# EAGLE design mmc5toflash (EAGLE 9.6.2)
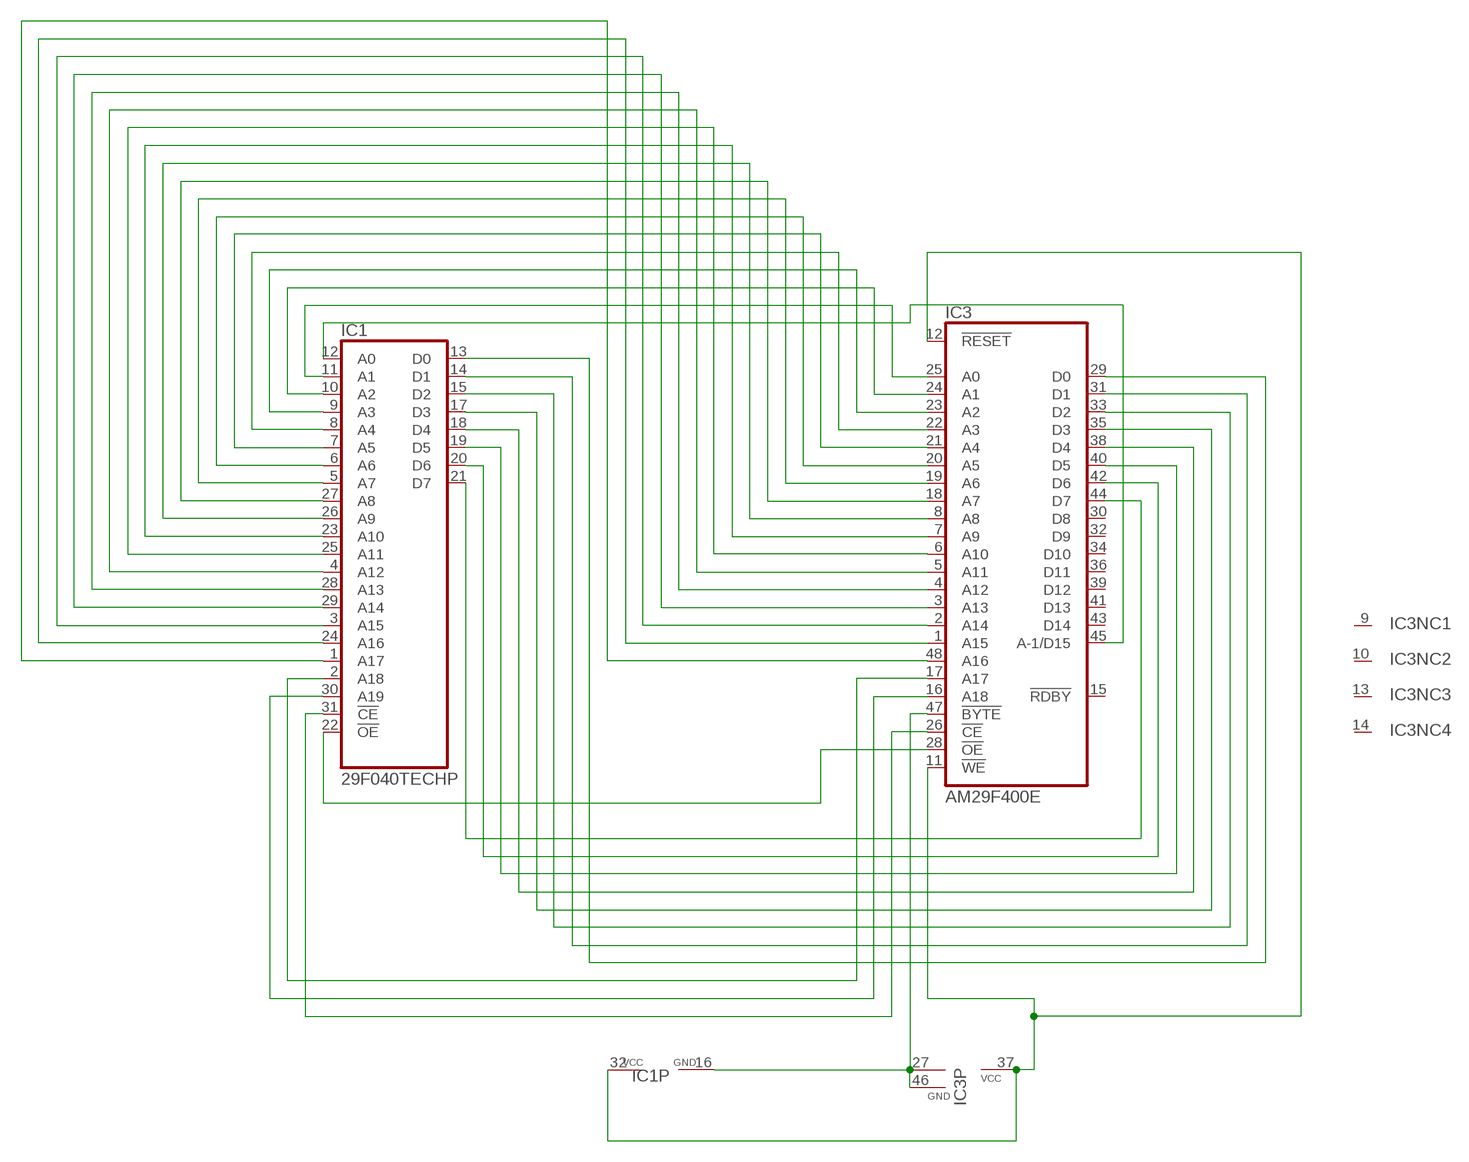
[diagram p0: schematic, sheet 1]

## Parts
IC1  29F040TECHP  [DIL32-3]
IC3  AM29F400E  [TSOP48]

## Nets
MMC5-!CE: IC1.31(!CE) IC3.26(!CE)
MMC5-!OE: IC1.22(!OE) IC3.28(!OE)
MMC5-A0: IC1.12(A0) IC3.45(A-1/D15)
MMC5-A1: IC1.11(A1) IC3.25(A0)
MMC5-A2: IC1.10(A2) IC3.24(A1)
MMC5-A3: IC1.9(A3) IC3.23(A2)
MMC5-A4: IC1.8(A4) IC3.22(A3)
MMC5-A5: IC1.7(A5) IC3.21(A4)
MMC5-A6: IC1.6(A6) IC3.20(A5)
MMC5-A7: IC1.5(A7) IC3.19(A6)
MMC5-A8: IC1.27(A8) IC3.18(A7)
MMC5-A9: IC1.26(A9) IC3.8(A8)
MMC5-A10: IC1.23(A10) IC3.7(A9)
MMC5-A11: IC1.25(A11) IC3.6(A10)
MMC5-A12: IC1.4(A12) IC3.5(A11)
MMC5-A13: IC1.28(A13) IC3.4(A12)
MMC5-A14: IC1.29(A14) IC3.3(A13)
MMC5-A15: IC1.3(A15) IC3.2(A14)
MMC5-A16: IC1.24(A16) IC3.1(A15)
MMC5-A17: IC1.1(A17) IC3.48(A16)
MMC5-A18: IC1.2(A18) IC3.17(A17)
MMC5-A19: IC1.30(A19) IC3.16(A18)
MMC5-D0: IC1.13(D0) IC3.29(D0)
MMC5-D1: IC1.14(D1) IC3.31(D1)
MMC5-D2: IC1.15(D2) IC3.33(D2)
MMC5-D3: IC1.17(D3) IC3.35(D3)
MMC5-D4: IC1.18(D4) IC3.38(D4)
MMC5-D5: IC1.19(D5) IC3.40(D5)
MMC5-D6: IC1.20(D6) IC3.42(D6)
MMC5-D7: IC1.21(D7) IC3.44(D7)
MMC5-VCC: IC1.32(VCC) IC3.11(!WE) IC3.12(!RESET) IC3.37(VCC)
MMC5-VSS: IC1.16(GND) IC3.27(GND) IC3.46(GND) IC3.47(!BYTE)
Unconnected: IC3.9(NC) IC3.10(NC) IC3.13(NC) IC3.14(NC) IC3.15(!RDBY) IC3.30(D8) IC3.32(D9) IC3.34(D10) IC3.36(D11) IC3.39(D12) IC3.41(D13) IC3.43(D14)

## Library data of the parts
IC1 = MMC5:29F040: mmc5 rom
IC3 = custom 8-megabit am29-memory:AM29F400E: 4-Megabit FLASH MEMORY (512 K x 8 bit/256 K x 16 bit) 5 V-only

## Board
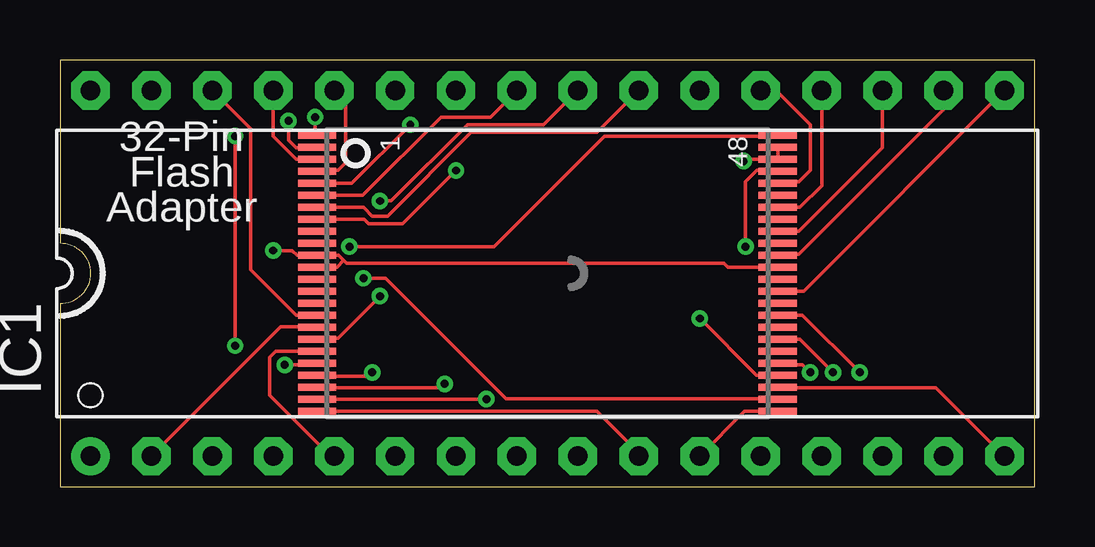
[diagram p1: board, top side]
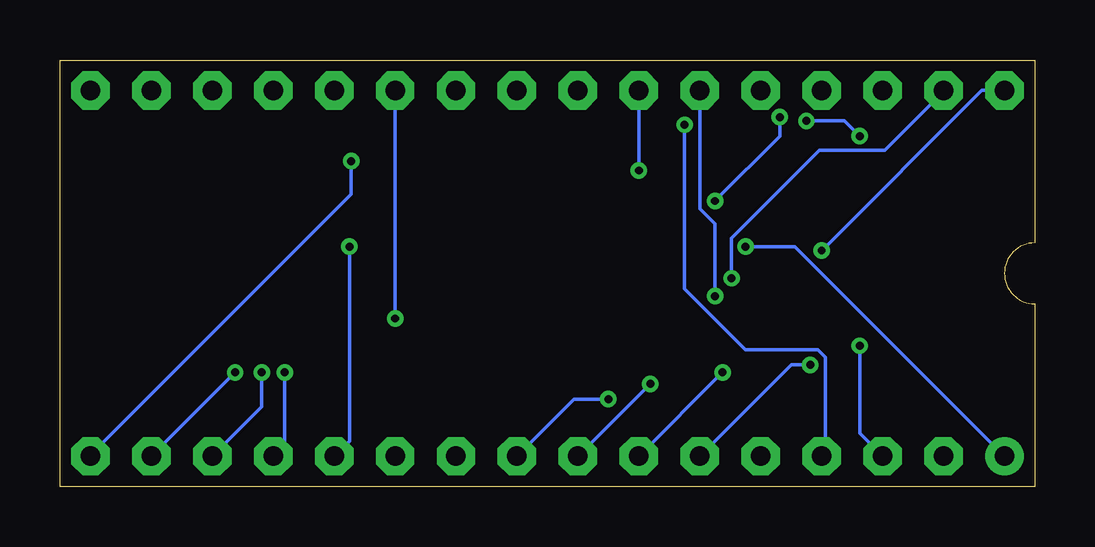
[diagram p2: board, bottom side, seen from below]

Size 40.64 x 17.78 mm. Coordinates in mm from the lower left corner, seen from the top.
Outline: 0,17.78 0,10.16 arc-180 0,7.62 0,0 40.64,0 40.64,17.78 0,17.78
Copper layers (1*16): Top 0.0356mm / dielectric 1.5011mm / Bottom 0.0356mm
Design rules "oshpark-2layer": minimum track width 6mil, minimum drill 13mil, track to track 6mil, track to pad 6mil, pad to pad 6mil, via to via 6mil, smd to smd 6mil, copper to edge 15mil, drill to drill 6mil, minimum pad ring 7mil, minimum via ring 7mil, stop-mask expansion 4mil, vias tented up to drill 0mil, thermal gap 10mil

### Footprints (pad centres in the part's own frame; a part is rotated, then mirrored left to right if it is on the bottom)
DIL32-3 = drill 0.813 pad 1.6: 1 -19.05,-7.62 | drill 0.813 pad 1.6 octagon: 2 -16.51,-7.62; 3 -13.97,-7.62; 4 -11.43,-7.62; 5 -8.89,-7.62; 6 -6.35,-7.62; 7 -3.81,-7.62; 8 -1.27,-7.62; 9 1.27,-7.62; 10 3.81,-7.62; 11 6.35,-7.62; 12 8.89,-7.62; 13 11.43,-7.62; 14 13.97,-7.62; 15 16.51,-7.62; 16 19.05,-7.62; 17 19.05,7.62; 18 16.51,7.62; 19 13.97,7.62; 20 11.43,7.62; 21 8.89,7.62; 22 6.35,7.62; 23 3.81,7.62; 24 1.27,7.62; 25 -1.27,7.62; 26 -3.81,7.62; 27 -6.35,7.62; 28 -8.89,7.62; 29 -11.43,7.62; 30 -13.97,7.62; 31 -16.51,7.62; 32 -19.05,7.62
TSOP48 = smd 0.3 x 1.6: 1 -5.75,-9.6; 2 -5.25,-9.6; 3 -4.75,-9.6; 4 -4.25,-9.6; 5 -3.75,-9.6; 6 -3.25,-9.6; 7 -2.75,-9.6; 8 -2.25,-9.6; 9 -1.75,-9.6; 10 -1.25,-9.6; 11 -0.75,-9.6; 12 -0.25,-9.6; 13 0.25,-9.6; 14 0.75,-9.6; 15 1.25,-9.6; 16 1.75,-9.6; 17 2.25,-9.6; 18 2.75,-9.6; 19 3.25,-9.6; 20 3.75,-9.6; 21 4.25,-9.6; 22 4.75,-9.6; 23 5.25,-9.6; 24 5.75,-9.6; 25 5.75,9.6; 26 5.25,9.6; 27 4.75,9.6; 28 4.25,9.6; 29 3.75,9.6; 30 3.25,9.6; 31 2.75,9.6; 32 2.25,9.6; 33 1.75,9.6; 34 1.25,9.6; 35 0.75,9.6; 36 0.25,9.6; 37 -0.25,9.6; 38 -0.75,9.6; 39 -1.25,9.6; 40 -1.75,9.6; 41 -2.25,9.6; 42 -2.75,9.6; 43 -3.25,9.6; 44 -3.75,9.6; 45 -4.25,9.6; 46 -4.75,9.6; 47 -5.25,9.6; 48 -5.75,9.6

### Placement (x,y rotation side)
IC1  20.32,8.89 0 top
IC3  20.32,8.89 270 top

### Tracks (layer width: path | path; a pad name or v marks a point on that pad's centre or on a via)
MMC5-!CE  (via drill 0.33)
  Top 0.152: v12.65,8.69 13.56,8.69 18.59,3.66 29.87,3.66 IC3.26
  Bottom 0.152: v12.65,8.69 12.65,10.36 8.99,14.02 6.25,14.02 3.81,16.46 IC1.31
MMC5-!OE  (via drill 0.33)
  Top 0.152: IC3.28 29.04,4.64 v26.67,7.01
  Bottom 0.152: IC1.22 v26.67,7.01
MMC5-A0  (via drill 0.33)
  Top 0.152: 30.02,13.11 IC3.45 29.84,13.18 29.05,13.18 28.57,12.7 v28.57,10
  Bottom 0.152: v28.57,10 28.57,1.91 IC1.12
MMC5-A1
  Top 0.152: IC3.25 28.54,3.14 IC1.11
MMC5-A2
  Top 0.152: 10.67,3.2 IC3.24 22.38,3.14 24.13,1.39 IC1.10
MMC5-A3  (via drill 0.33)
  Top 0.152: 10.82,3.66 IC3.23 10.79,3.65 v17.78,3.65
  Bottom 0.152: v17.78,3.65 19.21,3.65 IC1.9
MMC5-A4  (via drill 0.33)
  Top 0.152: 10.82,4.12 IC3.22 10.79,4.13 15.88,4.13 v16.03,4.29
  Bottom 0.152: IC1.8 v16.03,4.29
MMC5-A5  (via drill 0.33)
  Top 0.152: v13.02,4.76 12.86,4.6 10.79,4.6 IC3.21
  Bottom 0.152: IC1.7 v13.02,4.76
MMC5-A6  (via drill 0.33)
  Top 0.152: v9.37,5.08 10.64,5.08 IC3.20
  Bottom 0.152: v9.37,5.08 10.16,5.08 IC1.6
MMC5-A7
  Top 0.152: 10.67,5.64 IC3.19 9.61,5.64 9.6,5.65 8.98,5.65 8.73,5.4 8.73,3.81 11.27,1.27 IC1.5
MMC5-A8  (via drill 0.33)
  Top 0.152: v13.34,7.94 11.59,6.19 10.79,6.19 IC3.18
  Bottom 0.152: v13.34,7.94 13.34,10.95 13.97,11.59 IC1.27
MMC5-A9  (via drill 0.33)
  Top 0.152: 10.82,11.12 IC3.8 12.67,11.14 12.86,10.95 14.29,10.95 v16.51,13.18
  Bottom 0.152: IC1.26 v16.51,13.18
MMC5-A10
  Top 0.152: 10.67,11.58 IC3.7 12.65,11.64 13.02,11.27 13.65,11.27 17.14,14.76 22.38,14.76 IC1.23
MMC5-A11
  Top 0.152: 10.82,12.19 IC3.6 | IC1.25 17.94,15.4 15.88,15.4 12.62,12.14 IC3.6 | 10.79,12.22 IC3.6
MMC5-A12  (via drill 0.33)
  Top 0.152: 10.67,12.65 IC3.5 12.16,12.64 v14.61,15.08
  Bottom 0.152: v14.61,15.08 14.61,8.26 12.06,5.71 9.05,5.71 8.73,5.4 8.73,1.43 IC1.4
MMC5-A13
  Top 0.152: IC1.28 11.91,16.03 11.91,13.49 11.59,13.18 10.79,13.18 IC3.4
MMC5-A14
  Top 0.152: IC1.29 8.89,14.61 9.84,13.65 10.64,13.65 IC3.3
MMC5-A15  (via drill 0.33)
  Top 0.152: 10.67,14.17 IC3.2 10.64,14.13 9.84,14.13 9.53,14.45 v9.53,15.24 | v7.3,5.87 v7.3,14.61
  Bottom 0.152: v9.53,15.24 7.94,15.24 v7.3,14.61 | v7.3,5.87 7.3,2.22 IC1.3
MMC5-A16  (via drill 0.33)
  Top 0.152: v10.64,15.4 10.64,14.76 IC3.1 | v13.34,11.91 13.81,11.91 16.99,15.08 20.16,15.08 IC1.24
  Bottom 0.152: v10.64,15.4 10.64,14.61 v13.34,11.91
MMC5-A17  (via drill 0.33)
  Top 0.152: 29.87,14.63 IC3.48 29.84,14.61 22.7,14.61 18.1,10 v12.06,10
  Bottom 0.152: v12.06,10 10,10 IC1.1
MMC5-A18
  Top 0.152: IC1.2 9.21,6.67 10.64,6.67 IC3.17
MMC5-A19
  Top 0.152: IC1.30 7.94,14.92 7.94,9.05 9.84,7.14 10.64,7.14 IC3.16
MMC5-D0  (via drill 0.33)
  Top 0.152: 29.87,5.18 IC3.29 30,5.08 30.96,5.08 v31.27,4.76
  Bottom 0.152: v31.27,4.76 31.27,1.75 IC1.13
MMC5-D1  (via drill 0.33)
  Top 0.152: IC3.31 30.85,6.14 v32.23,4.76
  Bottom 0.152: v32.23,4.76 32.23,3.33 IC1.14
MMC5-D2  (via drill 0.33)
  Top 0.152: 29.87,7.16 IC3.33 30,7.14 30.96,7.14 v33.34,4.76
  Bottom 0.152: IC1.15 v33.34,4.76
MMC5-D3
  Top 0.152: IC3.35 31,8.14 IC1.17
MMC5-D4
  Top 0.152: IC1.18 36.83,15.72 30.8,9.68 30,9.68 IC3.38
MMC5-D5
  Top 0.152: 29.87,10.67 IC3.40 30,10.64 30.8,10.64 34.29,14.13 IC1.19
MMC5-D6
  Top 0.152: 29.87,11.58 IC3.42 30.85,11.64 31.75,12.54 IC1.20
MMC5-D7
  Top 0.152: 29.87,12.65 IC3.44 30,12.7 30.8,12.7 31.27,13.18 31.27,15.08 29.84,16.51 IC1.21
MMC5-VCC  (via drill 0.33)
  Top 0.152: IC3.12 10.82,9.14 | 10.82,9.6 IC3.11 | 10.79,9.21 IC3.12 | 29.84,9.21 IC3.37 27.85,9.14 27.69,9.3 11.96,9.3 11.83,9.43 | v8.89,9.84 9.68,9.84 9.89,9.64 IC3.11 | 11.83,9.43 11.62,9.64 IC3.11 | 11.83,9.43 11.54,9.14 IC3.12
  Bottom 0.152: IC1.32 2.22,16.51 v8.89,9.84
MMC5-VSS  (via drill 0.33)
  Top 0.152: 30,13.65 IC3.46 | 30,14.13 IC3.47 IC3.46 | IC1.16 36.51,4.13 30,4.13 IC3.27 | IC3.46 28.57,13.64 v28.5,13.56
  Bottom 0.152: v28.5,13.56 28.5,12.19 39.32,1.37 IC1.16

### Text on the board
tSilk: 32-Pin / Flash / Adapter